# Altium project FPGA_SHIELD_MARK1.PrjPcb (part 1 of 2)
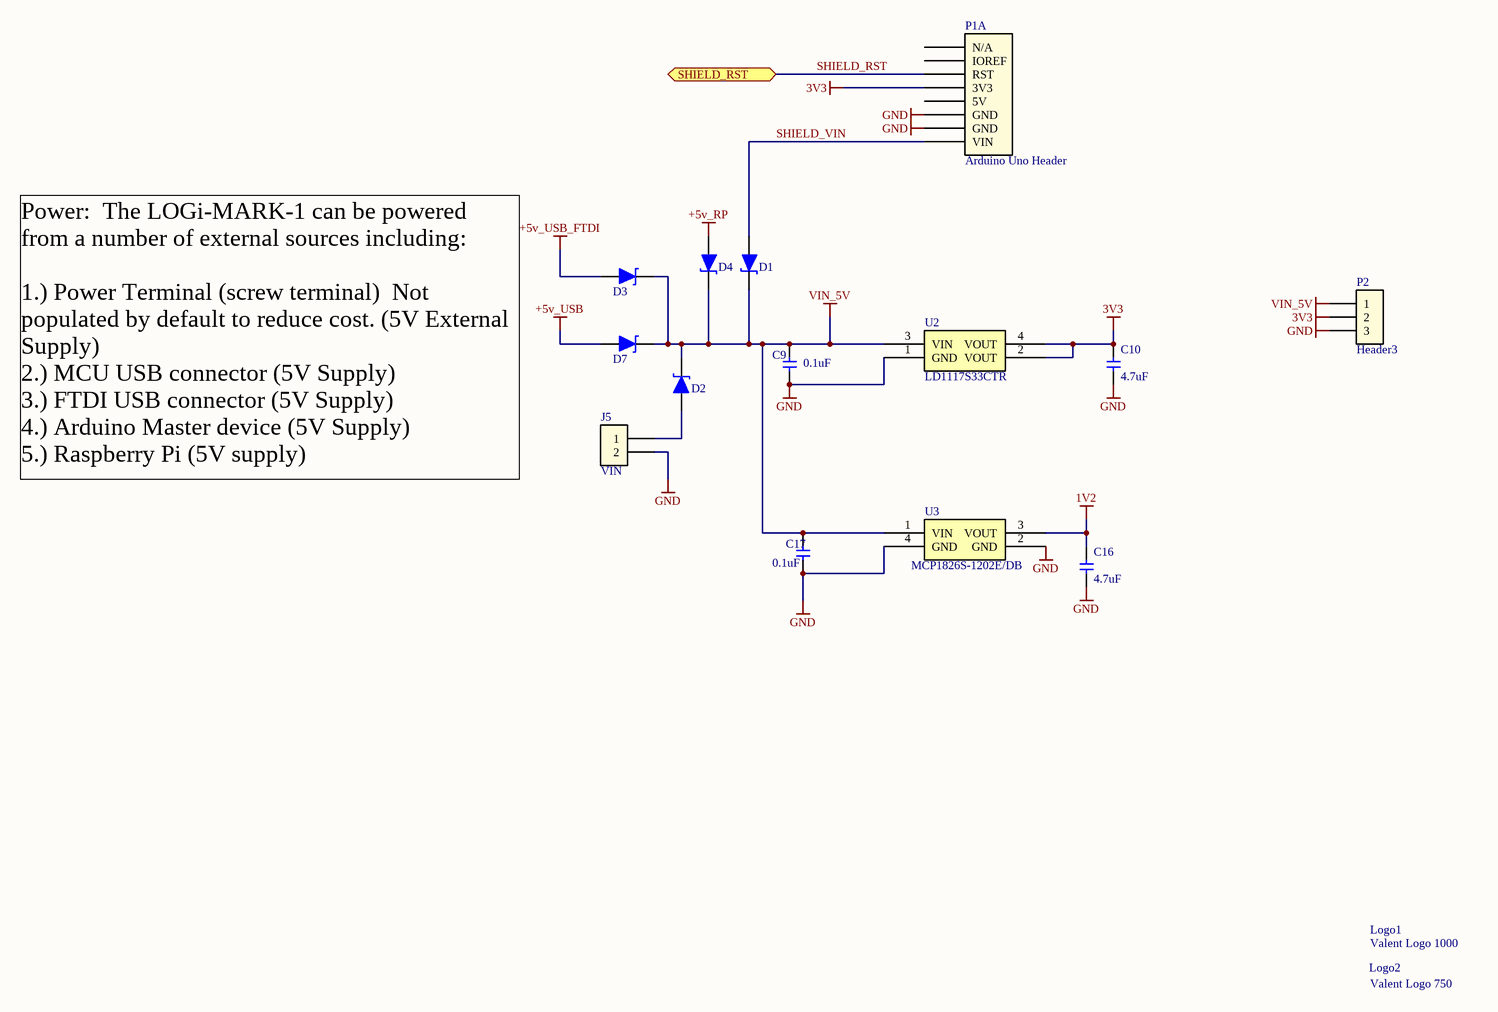
[diagram p0: POWER_SUPPLY.SchDoc]
Engineer: MJ/EH; PCB_TITLE: FPGA Mark 1; PCB_VERSION: a
7 sheets, 176 parts. Net scope: flat (ports and power ports of the same name join across sheets).
Board files: FPGA_SHIELD_MARK1_RA1_2.PcbDoc, MARK1_PANEL.PcbDoc
Sheets:
  POWER_SUPPLY.SchDoc
  LOGIC_FPGA.SchDoc
  FPGA_POWER_AND_CONFIGURATION.SchDoc
  DIGITAL_IO.SchDoc
  LOGIC_MCU.SchDoc
  PMOD_IO.SchDoc
  PERIPHERAL_PORT_IO.SchDoc

## Sheet POWER_SUPPLY.SchDoc: Power Supply
size B; Engineer: M. Jones; Organization: Michael Jones; DocumentNumber: 1; Revision: RA.1; SheetNumber: 1; SheetTotal: 7

### Parts
C9  0.1uF  [C0603]
C10  4.7uF  [C0603]
C16  4.7uF  [C0603]
C17  0.1uF  [C0603]
D1  RB161M-20TR  [SOD-123]  (value not drawn)
D2  RB161M-20TR  [SOD-123]  (value not drawn)
D3  RB161M-20TR  [SOD-123]  (value not drawn)
D4  RB161M-20TR  [SOD-123]  (value not drawn)
D7  RB161M-20TR  [SOD-123]  (value not drawn)
J5  VIN  [HEADER_2_40_100 THRU SIP]
Logo1  Valent Logo 1000  [ValentFX_1000]
Logo2  Valent Logo 750  [ValentFX_750]
P1  Arduino Uno Header  [Arduino Shield - smaller Thru]  (part A of 4)
P2  Header3  [HEADER_3_40_100 THRU SIP]
U2  LD1117S33CTR  [SOT223]
U3  MCP1826S-1202E/DB  [SOT223]

### Ports
SHIELD_RST

### Nets
1V2: C16.2 U3.3(VOUT)
3V3: C10.2 P1.A2(3V3) P2.2 U2.2(VOUT) U2.4(VOUT)
+5v_RP: D4.2(A)
+5v_USB: D7.2(A)
+5v_USB_FTDI: D3.2(A)
GND: C9.1 C10.1 C16.1 C17.1 J5.2 P1.A4(GND) P1.A5(GND) P2.3 U2.1(GND) U3.2(GND) U3.4(GND)
VIN_5V: C9.2 C17.2 D1.1(C) D2.1(C) D3.1(C) D4.1(C) D7.1(C) P2.1 U2.3(VIN) U3.1(VIN)
SHIELD_RST: P1.A1(RST) ; port SHIELD_RST
SHIELD_VIN: D1.2(A) P1.A6(VIN)
NetD2_2: D2.2(A) J5.1

Not connected (* = marked no-connect by the designer): P1 A0(IOREF) A3(5V) A-1(N/A)

### Notes on the sheet
- Power:  The LOGi-MARK-1 can be powered from a number of external sources including:
  1.) Power Terminal (screw terminal)  Not populated by default to reduce cost. (5V External Supply)
  2.) MCU USB connector (5V Supply)
  3.) FTDI USB connector (5V Supply)
  4.) Arduino Master device (5V Supply)
  5.) Raspberry Pi (5V supply)
- Title
- Revision:
- Sheet
- of
- Date:
- Engineer:
- (in symbol Valent Logo 750) VALENTFX-LOGO-750

### Library data of the parts
C9 C17 = GRM188R71H104KA93D: CAP CER .1UF 50V 10% X7R 0603; Manufacturer: Murata Electronics North America; Capacitance: 0.1µF; Value: 0.1uF; Supplier 1: Digi-Key; Supplier Part Number 1: 490-1519-1-ND; Manufacturer Part Number: GRM188R71H104KA93D; RoHS: RoHS Compliant; Category: Capacitors; Stock 1: 6315460; Pricing 1: 10=0.037, 100=0.0221, 500=0.01276, 1000=0.00884 (USD); Voltage - Rated: 50V; Tolerance: ±10%; Temperature Coefficient: X7R; Mounting Type: Surface Mount, MLCC; Operating Temperature: -55°C ~ 125°C; Features: -; Applications: General Purpose; Ratings: -; Package / Case: 0603 (1608 Metric); Size / Dimension: 0.063" L x 0.031" W (1.60mm x 0.80mm); Lead Spacing: -; Thickness: 0.80mm; Packaging: Cut Tape (CT); Lead Style: -; ComponentLink1URL: http://search.murata.co.jp/Ceramy/image/img/PDF/ENG/GRM188R71H104KA93.pdf; ComponentLink1Description: http://search.murata.co.jp/Ceramy/image/img/PDF/ENG/GRM188R71H104KA93.pdf
C10 C16 = GRM188R60J475KE19D: CAP CER 4.7UF 6.3V X5R 0603; Manufacturer: Murata Electronics North America; Capacitance: 4.7µF; Tolerance: ±10%; Supplier 1: Digi-Key; Supplier Part Number 1: 490-3297-1-ND; Manufacturer Part Number: GRM188R60J475KE19D; RoHS: RoHS Compliant; Category: Capacitors; Stock 1: 714091; Pricing 1: 10=0.214, 50=0.148, 100=0.1142, 250=0.08204, 500=0.0585, 1000=0.04281 (USD); Voltage - Rated: 6.3V; Temperature Coefficient: X5R; Mounting Type: Surface Mount, MLCC; Operating Temperature: -55°C ~ 85°C; Applications: General Purpose; Ratings: -; Package / Case: 0603 (1608 Metric); Size / Dimension: 0.063" L x 0.031" W (1.60mm x 0.80mm); Height: -; Thickness: 0.035" (0.90mm); Lead Spacing: -; Features: -; Packaging: Cut Tape (CT); Lead Style: -; ComponentLink1URL: http://search.murata.co.jp/Ceramy/image/img/PDF/ENG/GRM188R60J475KE19.pdf; ComponentLink1Description: http://search.murata.co.jp/Ceramy/image/img/PDF/ENG/GRM188R60J475KE19.pdf; Value: 4.7uF
D1-D4 D7 = RB161M-20TR: DIODE SCHOTTKY 25V 1A SOD123; Source Part Number: RB161M-20CT-ND; Manufacturer: Diodes Inc; Manufacturer Part Number: Rohm Semiconductor; Description: DIODE SCHOTTKY 20V 1A SOD123; Voltage - Forward (Vf) (Max) @ If: 350mV @ 1A; Voltage - DC Reverse (Vr) (Max): 20V; Current - Reverse Leakage @ Vr: 700µA @ 20V; Speed: Fast Recovery =< 500ns, > 200mA (Io); Source: Digikey; Value: RB161M-20TR; Supplier 1: Digi-Key; RoHS: RoHS Compliant; Category: Discrete Semiconductor Products; Stock 1: 29589; Pricing 1: 1=0.58, 25=0.4044, 100=0.3465, 250=0.29924, 500=0.25726, 1000=0.1995 (USD); Current - Average Rectified (Io): 1A; Diode Type: Schottky; Reverse Recovery Time (trr): -; Capacitance @ Vr, F: -; Mounting Type: Surface Mount; Package / Case: SOD-123F; Supplier Device Package: PMDU; Packaging: Cut Tape (CT); ComponentLink1URL: http://www.rohm.com/products/databook/di/pdf/rb161m-20.pdf; ComponentLink1Description: http://www.rohm.com/products/databook/di/pdf/rb161m-20.pdf; Supplier Part Number 1: RB161M-20CT-ND
J5 = Header2: Header 2 pin
P1 = Arduino Shield: Arduino Duem Header
P2 = Header3: Header  pin
U2 = LD1117S33CTR: IC REG LDO 3.3V 950MA SOT-223; Manufacturer: STMicroelectronics; Regulator Topology: Positive Fixed; Voltage - Input: Up to 15V; Voltage - Dropout (Typical): 1.1V @ 800mA; Number of Regulators: 1; Supplier 1: Digi-Key; Supplier Part Number 1: 497-1241-1-ND; Manufacturer Part Number: LD1117S33CTR; RoHS: RoHS Compliant; Category: Integrated Circuits (ICs); Stock 1: 20460; Pricing 1: 1=0.54, 10=0.436, 100=0.3267, 250=0.28216, 500=0.24256, 1000=0.1881 (USD); Voltage - Output: 3.3V; Current - Output: 950mA; Current - Limit (Min): -; Operating Temperature: -40°C ~ 125°C; Mounting Type: Surface Mount; Package / Case: TO-261-4, TO-261AA; Supplier Device Package: SOT-223; Packaging: Cut Tape (CT); ComponentLink1URL: http://www.st.com/internet/com/TECHNICAL_RESOURCES/TECHNICAL_LITERATURE/DATASHEET/CD00000544.pdf; ComponentLink1Description: http://www.st.com/internet/com/TECHNICAL_RESOURCES/TECHNICAL_LITERATURE/DATASHEET/CD00000544.pdf; value: LD1117S33CTR
U3 = MCP1826S-1202E/DB: IC LDO REG 1A 1.2V SOT223-3; Manufacturer: Microchip Technology; Regulator Topology: Positive Fixed; Voltage - Input: Up to 6V; Voltage - Dropout (Typical): 0.25V @ 1A; Number of Regulators: 1; Current - Output: 1A (Min); Value: MCP1826S-1202E/DB; Supplier 1: Digi-Key; Supplier Part Number 1: MCP1826S-1202E/DB-ND; Manufacturer Part Number: MCP1826S-1202E/DB; RoHS: RoHS Compliant; Category: Integrated Circuits (ICs); Stock 1: 2041; Pricing 1: 1=0.74, 10=0.68, 25=0.57, 100=0.52 (USD); Voltage - Output: 1.2V; Current - Limit (Min): -; Operating Temperature: -40°C ~ 125°C; Mounting Type: Surface Mount; Package / Case: TO-261-4, TO-261AA; Supplier Device Package: SOT-223-3; Packaging: Tube; ComponentLink1URL: http://ww1.microchip.com/downloads/en/DeviceDoc/22057a.pdf; ComponentLink1Description: http://ww1.microchip.com/downloads/en/DeviceDoc/22057a.pdf

## Sheet LOGIC_FPGA.SchDoc: FPGA Logic
size B; Engineer: M. Jones; Organization: Michael Jones; DocumentNumber: 2; Revision: RA.1; SheetNumber: 2; SheetTotal: 7
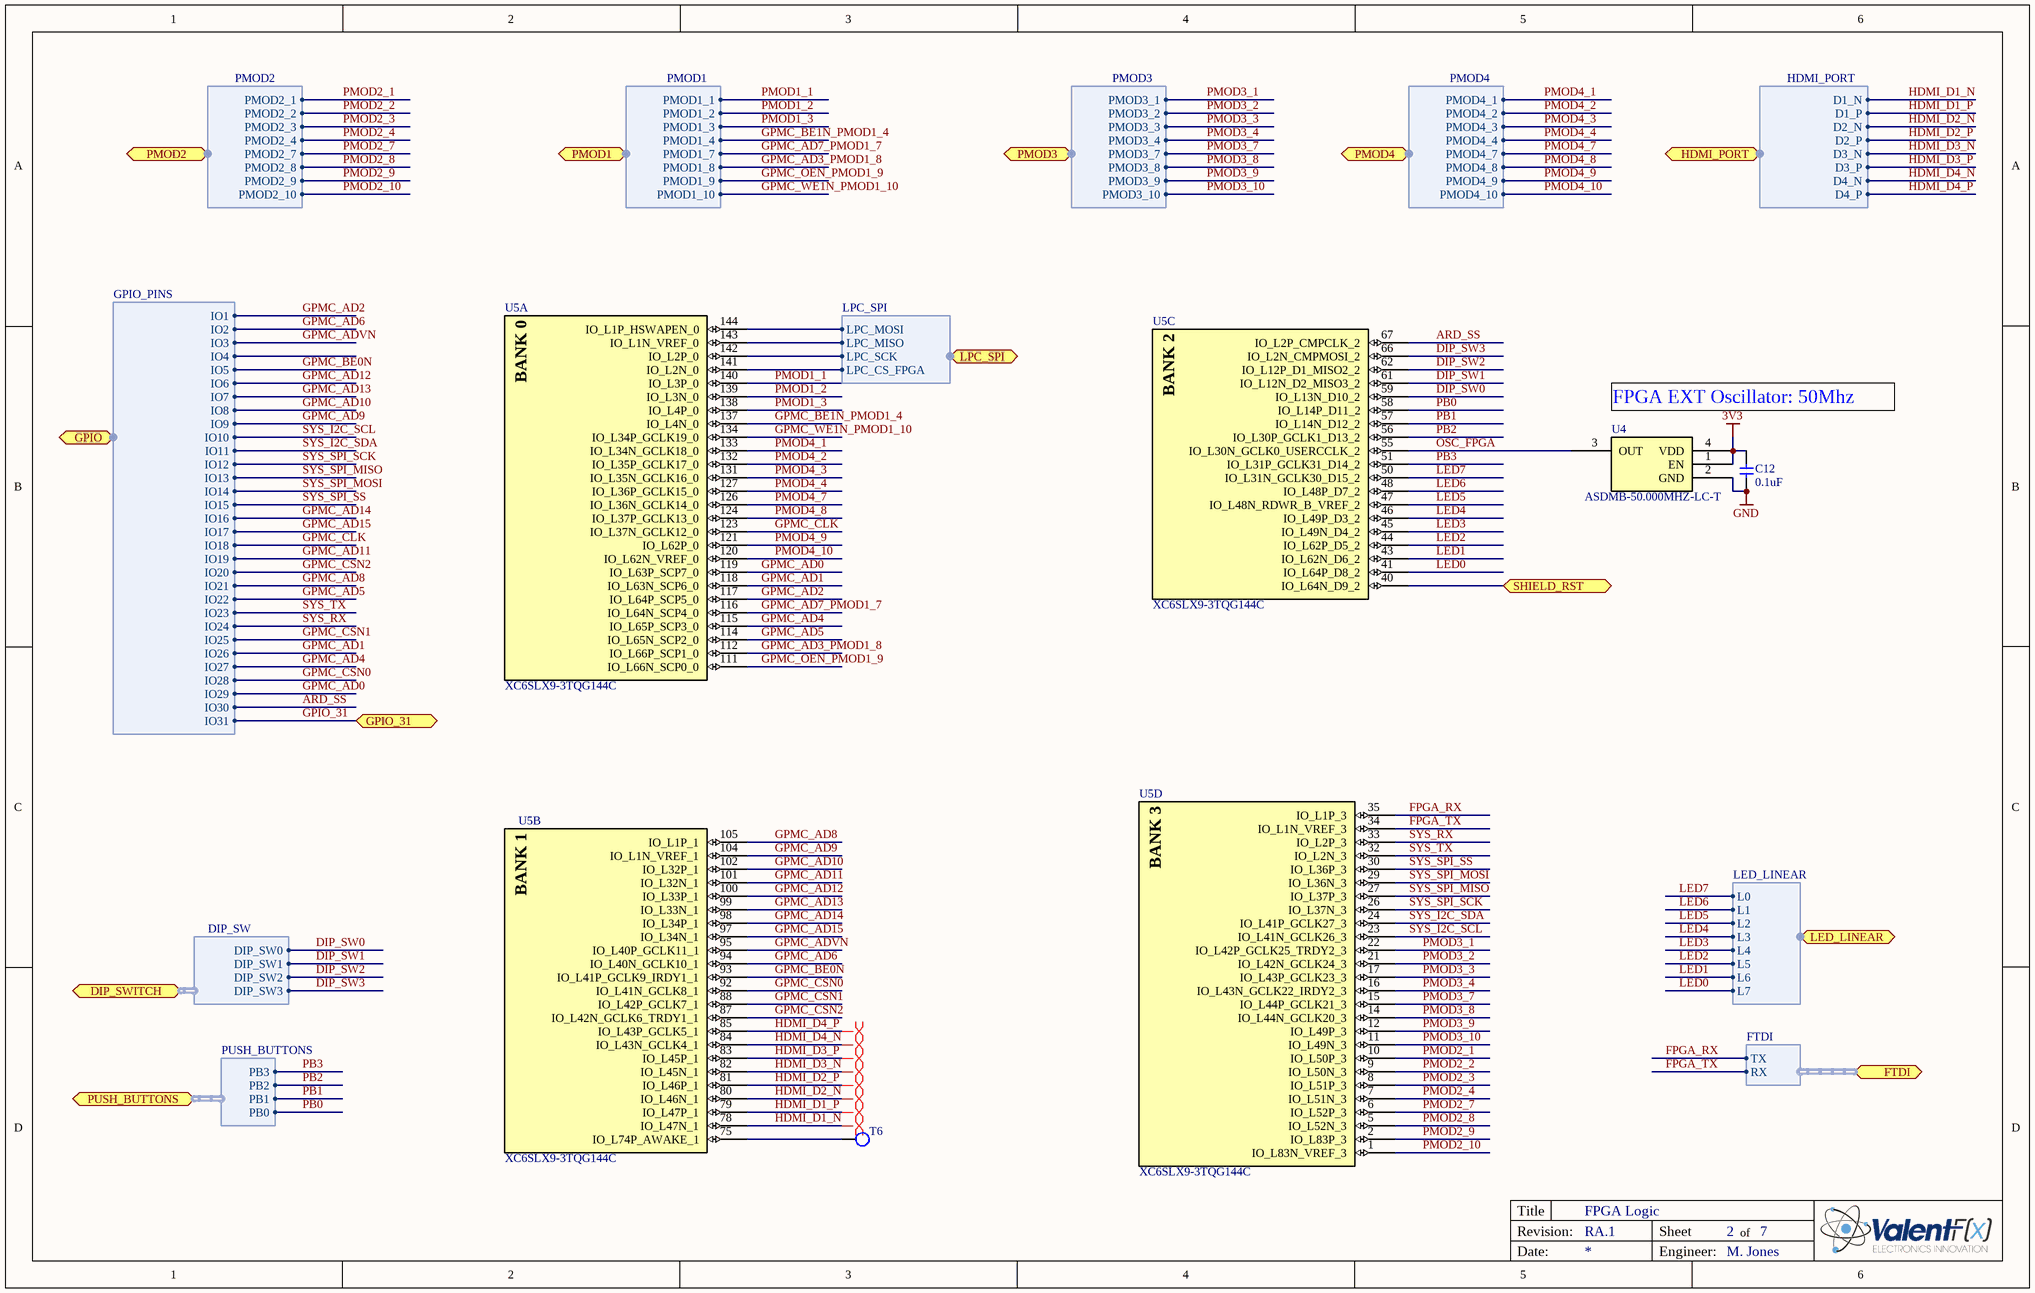
[diagram p1: LOGIC_FPGA.SchDoc]

### Parts
C12  0.1uF  [C0603]
T6  Test Point  [tp 18-28]  (value not drawn)
U4  ASDMB-50.000MHZ-LC-T  [ASDMB - osc]
U5  XC6SLX9-3TQG144C  [TQ144_L]  (parts A,B,C,D of 7)

### Ports
DIP_SWITCH (harness DIP_SW), FTDI (harness FTDI), GPIO (harness GPIO_PINS), GPIO_31, HDMI_PORT (harness HDMI_PORT), LED_LINEAR (harness LED_LINEAR), LPC_SPI (harness LPC_SPI), PMOD1 (harness PMOD1), PMOD2 (harness PMOD2), PMOD3 (harness PMOD3), PMOD4 (harness PMOD4), PUSH_BUTTONS (harness PUSH_BUTTONS), SHIELD_RST

### Harnesses
DIP_SW: DIP_SW0, DIP_SW1, DIP_SW2, DIP_SW3
PUSH_BUTTONS: PB0, PB1, PB2, PB3
LED_LINEAR: L0, L1, L2, L3, L4, L5, L6, L7
PMOD2: PMOD2_1, PMOD2_2, PMOD2_3, PMOD2_4, PMOD2_7, PMOD2_8, PMOD2_9, PMOD2_10
PMOD3: PMOD3_1, PMOD3_2, PMOD3_3, PMOD3_4, PMOD3_7, PMOD3_8, PMOD3_9, PMOD3_10
PMOD4: PMOD4_1, PMOD4_2, PMOD4_3, PMOD4_4, PMOD4_7, PMOD4_8, PMOD4_9, PMOD4_10
FTDI: TX, RX
GPIO_PINS: IO1, IO2, IO3, IO4, IO5, IO6, IO7, IO8, IO9, IO10, IO11, IO12, IO13, IO14, IO15, IO16, IO17, IO18, IO19, IO20, IO21, IO22, IO23, IO24, IO25, IO26, IO27, IO28, IO29, IO30, IO31
HDMI_PORT: D1_P, D1_N, D2_N, D3_N, D4_N, D2_P, D3_P, D4_P
LPC_SPI: LPC_MOSI, LPC_MISO, LPC_SCK, LPC_CS_FPGA
PMOD1: PMOD1_1, PMOD1_2, PMOD1_3, PMOD1_4, PMOD1_7, PMOD1_8, PMOD1_9, PMOD1_10

### Nets
3V3: C12.2 U4.1(EN) U4.4(VDD)
GND: C12.1 U4.2(GND)
ARD_SS: U5.67(IO_L2P_CMPCLK_2) ; port GPIO.IO30
DIP_SW0: U5.59(IO_L13N_D10_2) ; port DIP_SWITCH.DIP_SW0
DIP_SW1: U5.61(IO_L12N_D2_MISO3_2) ; port DIP_SWITCH.DIP_SW1
DIP_SW2: U5.62(IO_L12P_D1_MISO2_2) ; port DIP_SWITCH.DIP_SW2
DIP_SW3: U5.66(IO_L2N_CMPMOSI_2) ; port DIP_SWITCH.DIP_SW3
FPGA_RX: U5.35(IO_L1P_3) ; port FTDI.TX
FPGA_TX: U5.34(IO_L1N_VREF_3) ; port FTDI.RX
GPIO_31: port GPIO_31, port GPIO.IO31
GPMC_AD0: U5.119(IO_L63P_SCP7_0) ; port GPIO.IO29
GPMC_AD1: U5.118(IO_L63N_SCP6_0) ; port GPIO.IO26
GPMC_AD2: U5.117(IO_L64P_SCP5_0) ; port GPIO.IO1
GPMC_AD3_PMOD1_8: U5.112(IO_L66P_SCP1_0) ; port PMOD1.PMOD1_8
GPMC_AD4: U5.115(IO_L65P_SCP3_0) ; port GPIO.IO27
GPMC_AD5: U5.114(IO_L65N_SCP2_0) ; port GPIO.IO22
GPMC_AD6: U5.94(IO_L40N_GCLK10_1) ; port GPIO.IO2
GPMC_AD7_PMOD1_7: U5.116(IO_L64N_SCP4_0) ; port PMOD1.PMOD1_7
GPMC_AD8: U5.105(IO_L1P_1) ; port GPIO.IO21
GPMC_AD9: U5.104(IO_L1N_VREF_1) ; port GPIO.IO9
GPMC_AD10: U5.102(IO_L32P_1) ; port GPIO.IO8
GPMC_AD11: U5.101(IO_L32N_1) ; port GPIO.IO19
GPMC_AD12: U5.100(IO_L33P_1) ; port GPIO.IO6
GPMC_AD13: U5.99(IO_L33N_1) ; port GPIO.IO7
GPMC_AD14: U5.98(IO_L34P_1) ; port GPIO.IO16
GPMC_AD15: U5.97(IO_L34N_1) ; port GPIO.IO17
GPMC_ADVN: U5.95(IO_L40P_GCLK11_1) ; port GPIO.IO3
GPMC_BE0N: U5.93(IO_L41P_GCLK9_IRDY1_1) ; port GPIO.IO5
GPMC_BE1N_PMOD1_4: U5.137(IO_L4N_0) ; port PMOD1.PMOD1_4
GPMC_CLK: U5.123(IO_L37N_GCLK12_0) ; port GPIO.IO18
GPMC_CSN0: U5.92(IO_L41N_GCLK8_1) ; port GPIO.IO28
GPMC_CSN1: U5.88(IO_L42P_GCLK7_1) ; port GPIO.IO25
GPMC_CSN2: U5.87(IO_L42N_GCLK6_TRDY1_1) ; port GPIO.IO20
GPMC_OEN_PMOD1_9: U5.111(IO_L66N_SCP0_0) ; port PMOD1.PMOD1_9
GPMC_WE1N_PMOD1_10: U5.134(IO_L34P_GCLK19_0) ; port PMOD1.PMOD1_10
HDMI_D1_N: U5.78(IO_L47N_1) ; port HDMI_PORT.D1_N
HDMI_D1_P: U5.79(IO_L47P_1) ; port HDMI_PORT.D1_P
HDMI_D2_N: U5.80(IO_L46N_1) ; port HDMI_PORT.D2_N
HDMI_D2_P: U5.81(IO_L46P_1) ; port HDMI_PORT.D2_P
HDMI_D3_N: U5.82(IO_L45N_1) ; port HDMI_PORT.D3_N
HDMI_D3_P: U5.83(IO_L45P_1) ; port HDMI_PORT.D3_P
HDMI_D4_N: U5.84(IO_L43N_GCLK4_1) ; port HDMI_PORT.D4_N
HDMI_D4_P: U5.85(IO_L43P_GCLK5_1) ; port HDMI_PORT.D4_P
LED0: U5.41(IO_L64P_D8_2) ; port LED_LINEAR.L7
LED1: U5.43(IO_L62N_D6_2) ; port LED_LINEAR.L6
LED2: U5.44(IO_L62P_D5_2) ; port LED_LINEAR.L5
LED3: U5.45(IO_L49N_D4_2) ; port LED_LINEAR.L4
LED4: U5.46(IO_L49P_D3_2) ; port LED_LINEAR.L3
LED5: U5.47(IO_L48N_RDWR_B_VREF_2) ; port LED_LINEAR.L2
LED6: U5.48(IO_L48P_D7_2) ; port LED_LINEAR.L1
LED7: U5.50(IO_L31N_GCLK30_D15_2) ; port LED_LINEAR.L0
LPC_CS_FPGA: U5.141(IO_L2N_0) ; port LPC_SPI.LPC_CS_FPGA
MISO: U5.143(IO_L1N_VREF_0) ; port LPC_SPI.LPC_MISO
MOSI_SWO: U5.144(IO_L1P_HSWAPEN_0) ; port LPC_SPI.LPC_MOSI
OSC_FPGA: U4.3(OUT) U5.55(IO_L30N_GCLK0_USERCCLK_2)
PB0: U5.58(IO_L14P_D11_2) ; port PUSH_BUTTONS.PB0
PB1: U5.57(IO_L14N_D12_2) ; port PUSH_BUTTONS.PB1
PB2: U5.56(IO_L30P_GCLK1_D13_2) ; port PUSH_BUTTONS.PB2
PB3: U5.51(IO_L31P_GCLK31_D14_2) ; port PUSH_BUTTONS.PB3
PMOD1_1: U5.140(IO_L3P_0) ; port PMOD1.PMOD1_1
PMOD1_2: U5.139(IO_L3N_0) ; port PMOD1.PMOD1_2
PMOD1_3: U5.138(IO_L4P_0) ; port PMOD1.PMOD1_3
PMOD2_1: U5.10(IO_L50P_3) ; port PMOD2.PMOD2_1
PMOD2_2: U5.9(IO_L50N_3) ; port PMOD2.PMOD2_2
PMOD2_3: U5.8(IO_L51P_3) ; port PMOD2.PMOD2_3
PMOD2_4: U5.7(IO_L51N_3) ; port PMOD2.PMOD2_4
PMOD2_7: U5.6(IO_L52P_3) ; port PMOD2.PMOD2_7
PMOD2_8: U5.5(IO_L52N_3) ; port PMOD2.PMOD2_8
PMOD2_9: U5.2(IO_L83P_3) ; port PMOD2.PMOD2_9
PMOD2_10: U5.1(IO_L83N_VREF_3) ; port PMOD2.PMOD2_10
PMOD3_1: U5.22(IO_L42P_GCLK25_TRDY2_3) ; port PMOD3.PMOD3_1
PMOD3_2: U5.21(IO_L42N_GCLK24_3) ; port PMOD3.PMOD3_2
PMOD3_3: U5.17(IO_L43P_GCLK23_3) ; port PMOD3.PMOD3_3
PMOD3_4: U5.16(IO_L43N_GCLK22_IRDY2_3) ; port PMOD3.PMOD3_4
PMOD3_7: U5.15(IO_L44P_GCLK21_3) ; port PMOD3.PMOD3_7
PMOD3_8: U5.14(IO_L44N_GCLK20_3) ; port PMOD3.PMOD3_8
PMOD3_9: U5.12(IO_L49P_3) ; port PMOD3.PMOD3_9
PMOD3_10: U5.11(IO_L49N_3) ; port PMOD3.PMOD3_10
PMOD4_1: U5.133(IO_L34N_GCLK18_0) ; port PMOD4.PMOD4_1
PMOD4_2: U5.132(IO_L35P_GCLK17_0) ; port PMOD4.PMOD4_2
PMOD4_3: U5.131(IO_L35N_GCLK16_0) ; port PMOD4.PMOD4_3
PMOD4_4: U5.127(IO_L36P_GCLK15_0) ; port PMOD4.PMOD4_4
PMOD4_7: U5.126(IO_L36N_GCLK14_0) ; port PMOD4.PMOD4_7
PMOD4_8: U5.124(IO_L37P_GCLK13_0) ; port PMOD4.PMOD4_8
PMOD4_9: U5.121(IO_L62P_0) ; port PMOD4.PMOD4_9
PMOD4_10: U5.120(IO_L62N_VREF_0) ; port PMOD4.PMOD4_10
SCK: U5.142(IO_L2P_0) ; port LPC_SPI.LPC_SCK
SHIELD_RST: U5.40(IO_L64N_D9_2) ; port SHIELD_RST
SYS_I2C_SCL: U5.23(IO_L41N_GCLK26_3) ; port GPIO.IO10
SYS_I2C_SDA: U5.24(IO_L41P_GCLK27_3) ; port GPIO.IO11
SYS_RX: U5.33(IO_L2P_3) ; port GPIO.IO24
SYS_SPI_MISO: U5.27(IO_L37P_3) ; port GPIO.IO13
SYS_SPI_MOSI: U5.29(IO_L36N_3) ; port GPIO.IO14
SYS_SPI_SCK: U5.26(IO_L37N_3) ; port GPIO.IO12
SYS_SPI_SS: U5.30(IO_L36P_3) ; port GPIO.IO15
SYS_TX: U5.32(IO_L2N_3) ; port GPIO.IO23
NetT6_1: T6.1 U5.75(IO_L74P_AWAKE_1)

### Layout directives
differential pair: HDMI_D1_N, HDMI_D1_P, HDMI_D2_N, HDMI_D2_P, HDMI_D3_N, HDMI_D3_P, HDMI_D4_N, HDMI_D4_P

### Notes on the sheet
- FPGA EXT Oscillator: 50Mhz
- Title
- Revision:
- Sheet
- of
- Date:
- Engineer:
- (in symbol XC6SLX9-3TQG144C, part A) BANK 0
- (in symbol XC6SLX9-3TQG144C, part B) BANK 1
- (in symbol XC6SLX9-3TQG144C, part C) BANK 2
- (in symbol XC6SLX9-3TQG144C, part D) BANK 3

### Library data of the parts
C12 = GRM188R71H104KA93D: as C9 on sheet POWER_SUPPLY; Manufacturer Part Number: GRM188R71H104KA93D; Value: CAP CER .1UF 50V 10% X7R 0603; Supplier 1: Digi-Key; Supplier Part Number 1: 490-1519-1-ND; RoHS: RoHS Compliant; Category: Capacitors; Stock 1: 9370695; Pricing 1: 10=0.037, 100=0.0221, 500=0.01276, 1000=0.00884 (USD); Voltage - Rated: 50V; Tolerance: ±10%; Temperature Coefficient: X7R; Mounting Type: Surface Mount, MLCC; Operating Temperature: -55°C ~ 125°C; Features: -; Applications: General Purpose; Ratings: -; Package / Case: 0603 (1608 Metric); Size / Dimension: 0.063" L x 0.031" W (1.60mm x 0.80mm); Lead Spacing: -; Thickness: 0.80mm; Packaging: Cut Tape (CT); Lead Style: -; ComponentLink1URL: http://search.murata.co.jp/Ceramy/image/img/PDF/ENG/GRM188R71H104KA93.pdf; ComponentLink1Description: http://search.murata.co.jp/Ceramy/image/img/PDF/ENG/GRM188R71H104KA93.pdf
T6 = Test Point 2: Test Point Smaller Symbol
U4 = ASDMB-50.000MHZ-LC-T: OSC MEMS 50.000 MHZ SMD; Manufacturer: Abracon Corporation; Frequency: 50MHz; Function: Tri-State (Output Enable); Output: CMOS; Voltage - Supply: 1.8 V ~ 3.3 V; Frequency Stability: ±50ppm; Current - Supply (Max): 16mA; Current - Supply (Disable) (Max): 15µA; Supplier 1: Digi-Key; Manufacturer Part Number: ASDMB-50.000MHZ-LC-T; RoHS: RoHS Compliant; Category: Crystals and Oscillators; Stock 1: 967; Pricing 1: 1=1.69, 10=1.463, 50=1.2826, 100=1.0125, 500=0.855 (USD); Type: MEMS (Silicon); Operating Temperature: -40°C ~ 85°C; Mounting Type: Surface Mount; Size / Dimension: 0.098" L x 0.079" W (2.50mm x 2.00mm); Height: 0.035" (0.90mm); Package / Case: 4-SMD, No Lead (DFN, LCC); Packaging: Cut Tape (CT); ComponentLink1URL: http://www.abracon.com/Oscillators/ASDMB.pdf; ComponentLink1Description: http://www.abracon.com/Oscillators/ASDMB.pdf; Supplier Part Number 1: 535-11738-1-ND; Value: ASDMB-50.000MHZ-LC-T
U5 = XC6SLX9-3TQG144C: IC FPAG SPARTAN 6 9K 144TQFP; Manufacturer: Xilinx Inc; Number of Logic Elements/Cells: 9152; Number of LABs/CLBs: 715; Total RAM Bits: 589824; Number of I /O: 102; Voltage - Supply: 1.14 V ~ 1.26 V; Supplier 1: Digi-Key; Supplier Part Number 1: 122-1747-ND; Manufacturer Part Number: XC6SLX9-3TQG144C; RoHS: RoHS Compliant; Category: Integrated Circuits (ICs); Stock 1: 77; Pricing 1: 1=17.22 (USD); Number of Gates: -; Mounting Type: Surface Mount; Operating Temperature: 0°C ~ 85°C; Package / Case: 144-LQFP; Supplier Device Package: 144-TQFP (20x20); ComponentLink1URL: http://www.xilinx.com/support/documentation/data_sheets/ds160.pdf; ComponentLink1Description: http://www.xilinx.com/support/documentation/data_sheets/ds160.pdf; Value: XC6SLX9-3TQG144C

## Sheet FPGA_POWER_AND_CONFIGURATION.SchDoc: FPGA Configuration
size B; Engineer: M. Jones; Organization: Michael Jones; DocumentNumber: 3; Revision: RA.1; SheetNumber: 3; SheetTotal: 7
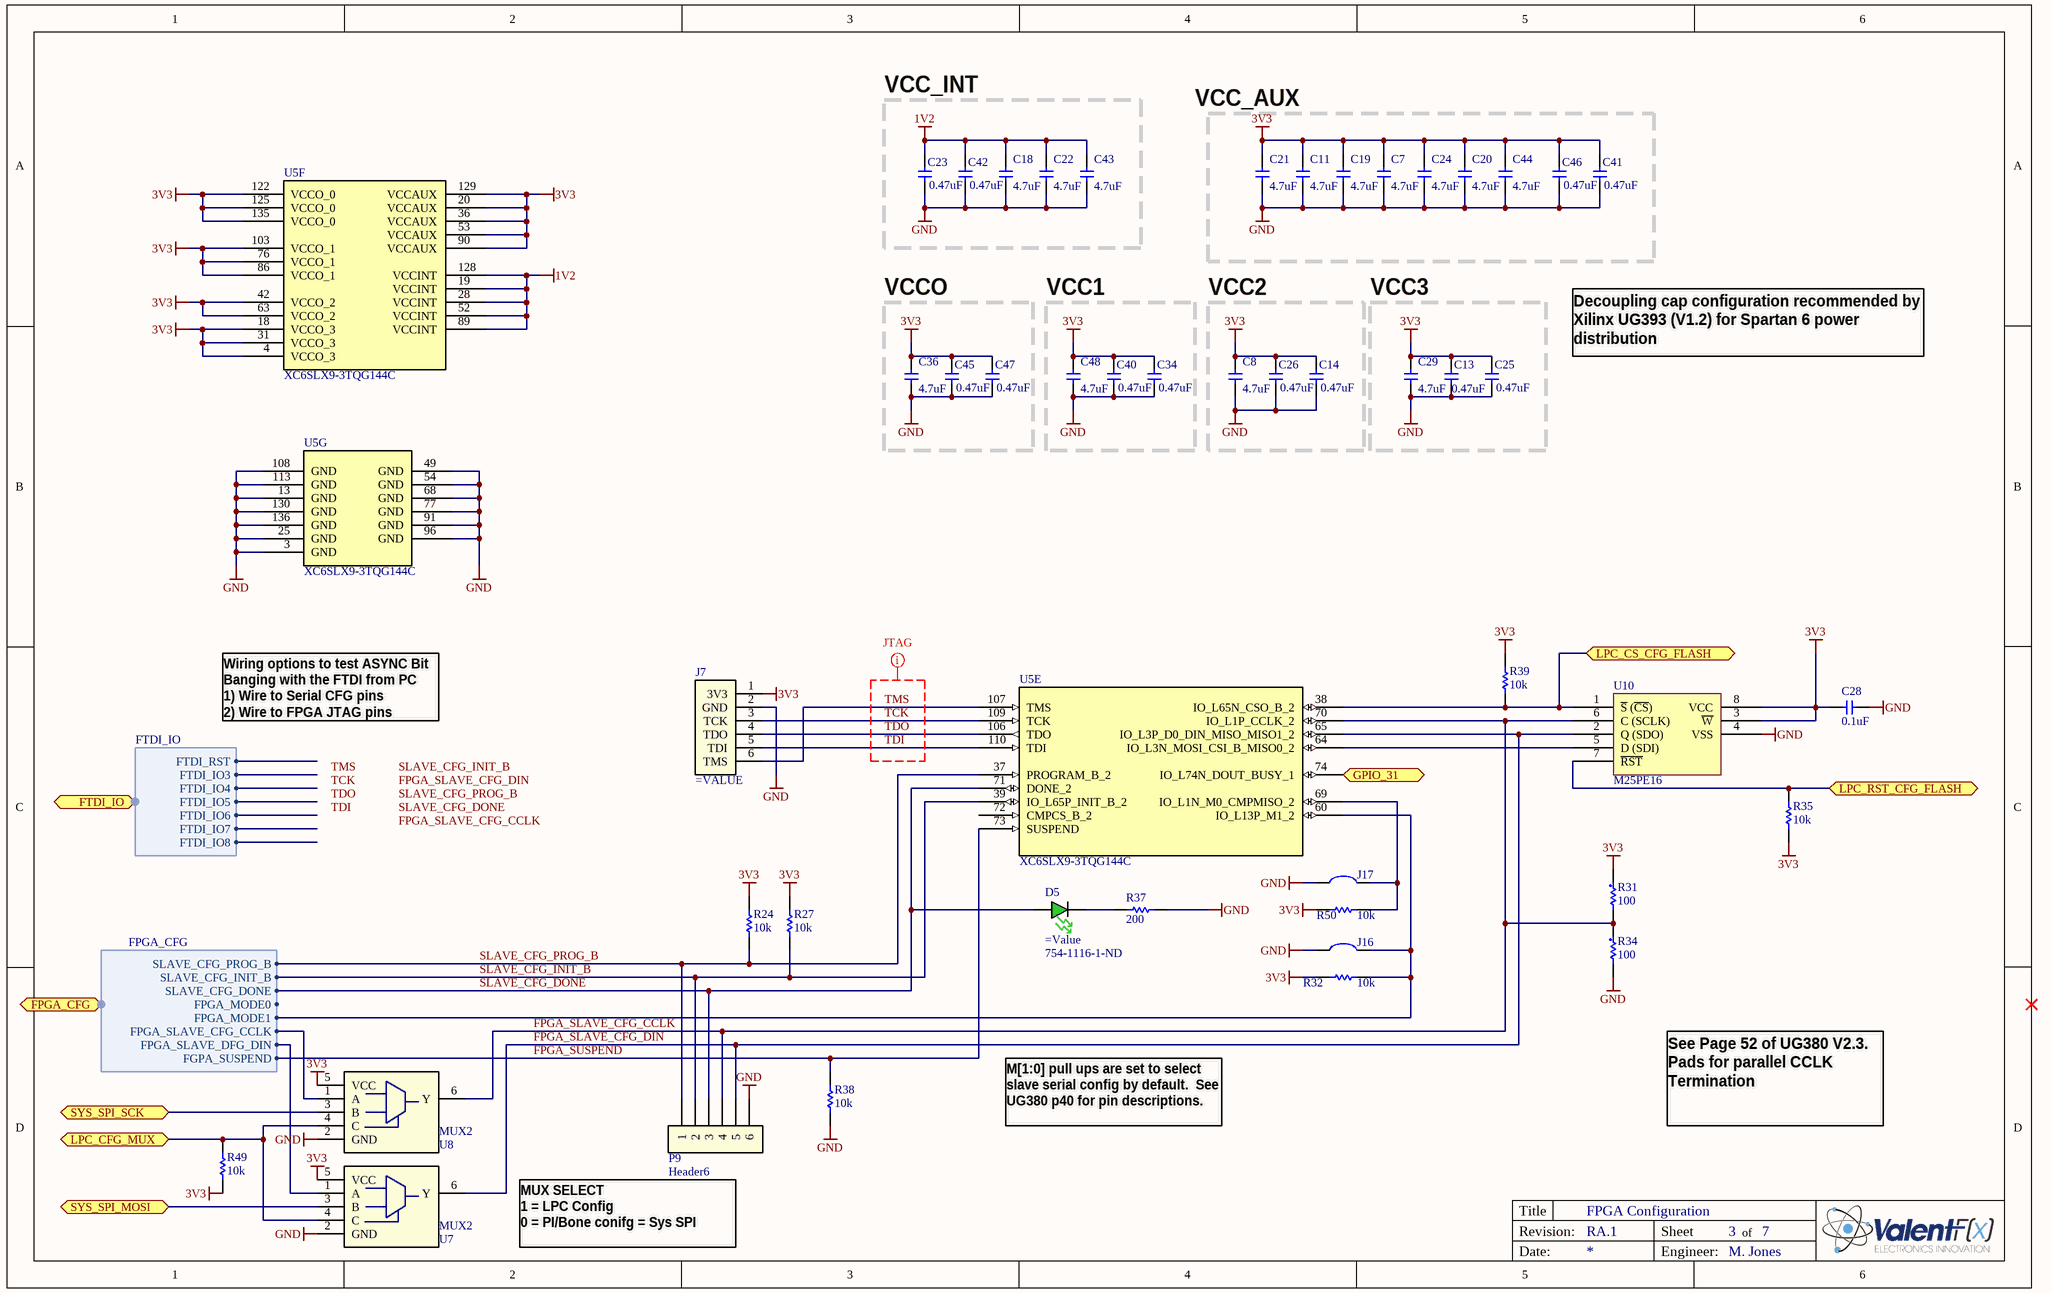
[diagram p2: FPGA_POWER_AND_CONFIGURATION.SchDoc]

### Parts
C7  4.7uF  [C0603]
C8  4.7uF  [C0603]
C11  4.7uF  [C0603]
C13  0.47uF  [C0603]
C14  0.47uF  [C0603]
C18  4.7uF  [C0603]
C19  4.7uF  [C0603]
C20  4.7uF  [C0603]
C21  4.7uF  [C0603]
C22  4.7uF  [C0603]
C23  0.47uF  [C0603]
C24  4.7uF  [C0603]
C25  0.47uF  [C0603]
C26  0.47uF  [C0603]
C28  0.1uF  [C0603]
C29  4.7uF  [C0603]
C34  0.47uF  [C0603]
C36  4.7uF  [C0603]
C40  0.47uF  [C0603]
C41  0.47uF  [C0603]
C42  0.47uF  [C0603]
C43  4.7uF  [C0603]
C44  4.7uF  [C0603]
C45  0.47uF  [C0603]
C46  0.47uF  [C0603]
C47  0.47uF  [C0603]
C48  4.7uF  [C0603]
D5  Supplier Part Number 1: 754-1116-1-ND  [LED_0603 - GREEN]
J7  (no value)  [JTAG - Digilent HS1]
J16  Solder Jumper  [SOLDER_JUMPER]  (value not drawn)  (no BOM)
J17  Solder Jumper  [SOLDER_JUMPER]  (value not drawn)  (no BOM)
P9  Header6  [HEADER_6_30_100 SMT SIP]
R24  10k  [R0603]
R27  10k  [R0603]
R31  100  [R0603]
R32  10k  [R0603]
R34  100  [R0603]
R35  10k  [R0603]
R37  200  [R0603]
R38  10k  [R0603]
R39  10k  [R0603]
R49  10k  [R0603]
R50  10k  [R0603]
U5  XC6SLX9-3TQG144C  [TQ144_L]  (parts E,F,G of 7)
U7  MUX2  [SC70-6]
U8  MUX2  [SC70-6]
U10  M25PE16  [SOIC127P830X200-8L]

### Blocks framed on the sheet
VCC_INT: C18 C22 C23 C42 C43
VCCO: C36 C45 C47
VCC1: C34 C40 C48
VCC2: C8 C14 C26
VCC3: C13 C25 C29

### Ports
FPGA_CFG (harness FPGA_CFG), FTDI_IO (harness FTDI_IO), GPIO_31, LPC_CFG_MUX, LPC_CS_CFG_FLASH, LPC_RST_CFG_FLASH, SYS_SPI_MOSI, SYS_SPI_SCK

### Harnesses
FPGA_CFG: SLAVE_CFG_PROG_B, SLAVE_CFG_INIT_B, SLAVE_CFG_DONE, FPGA_MODE0, FPGA_MODE1, FPGA_SLAVE_CFG_CCLK, FPGA_SLAVE_DFG_DIN, FGPA_SUSPEND
FTDI_IO: FTDI_IO3, FTDI_IO4, FTDI_IO5, FTDI_IO6, FTDI_IO7, FTDI_IO8, FTDI_RST

### Nets
1V2: C18.2 C22.2 C23.2 C42.2 C43.2 U5.19(VCCINT) U5.28(VCCINT) U5.52(VCCINT) U5.89(VCCINT) U5.128(VCCINT)
3V3: C7.2 C8.2 C11.2 C13.2 C14.2 C19.2 C20.2 C21.2 C24.2 C25.2 C26.2 C28.1 C29.2 C34.2 C36.2 C40.2 C41.2 C44.2 C45.2 C46.2 C47.2 C48.2 J7.1(3V3) R24.2 R27.2 R31.1 R32.1 R35.2 R39.2 R49.1 R50.1 U5.4(VCCO_3) U5.18(VCCO_3) U5.20(VCCAUX) U5.31(VCCO_3) U5.36(VCCAUX) U5.42(VCCO_2) U5.53(VCCAUX) U5.63(VCCO_2) U5.76(VCCO_1) U5.86(VCCO_1) U5.90(VCCAUX) U5.103(VCCO_1) U5.122(VCCO_0) U5.125(VCCO_0) U5.129(VCCAUX) U5.135(VCCO_0) U7.5(VCC) U8.5(VCC) U10.3(~{W}) U10.8(VCC)
GND: C7.1 C8.1 C11.1 C13.1 C14.1 C18.1 C19.1 C20.1 C21.1 C22.1 C23.1 C24.1 C25.1 C26.1 C28.2 C29.1 C34.1 C36.1 C40.1 C41.1 C42.1 C43.1 C44.1 C45.1 C46.1 C47.1 C48.1 J7.2(GND) J16.2 J17.2 P9.6 R34.2 R37.2 R38.1 U5.3(GND) U5.13(GND) U5.25(GND) U5.49(GND) U5.54(GND) U5.68(GND) U5.77(GND) U5.91(GND) U5.96(GND) U5.108(GND) U5.113(GND) U5.130(GND) U5.136(GND) U7.2(GND) U8.2(GND) U10.4(VSS)
CS_FPGA_FLASH: R39.1 U5.38(IO_L65N_CSO_B_2) U10.1(~{S}_(~{CS})) ; port LPC_CS_CFG_FLASH
FPGA_MODE1: J16.1 R32.2 U5.60(IO_L13P_M1_2) ; port FPGA_CFG.FPGA_MODE1
FPGA_SLAVE_CFG_CCLK: P9.4 R31.2 R34.1 U5.70(IO_L1P_CCLK_2) U8.6(Y) U10.6(C_(SCLK))
FPGA_SLAVE_CFG_DIN: P9.5 U5.65(IO_L3P_D0_DIN_MISO_MISO1_2) U7.6(Y) U10.2(Q_(SDO))
FPGA_SUSPEND: R38.2 U5.73(SUSPEND) ; port FPGA_CFG.FGPA_SUSPEND
GPIO_31: U5.74(IO_L74N_DOUT_BUSY_1) ; port GPIO_31
LPC_FPGA_SLAVE_CFG_CCLK: U8.1(A) ; port FPGA_CFG.FPGA_SLAVE_CFG_CCLK
LPC_FPGA_SLAVE_CFG_DIN: U7.1(A) ; port FPGA_CFG.FPGA_SLAVE_DFG_DIN
SLAVE_CFG_DONE: D5.A P9.3 U5.71(DONE_2) ; port FPGA_CFG.SLAVE_CFG_DONE
SLAVE_CFG_INIT_B: P9.2 R27.1 U5.39(IO_L65P_INIT_B_2) ; port FPGA_CFG.SLAVE_CFG_INIT_B
SLAVE_CFG_PROG_B: P9.1 R24.1 U5.37(PROGRAM_B_2) ; port FPGA_CFG.SLAVE_CFG_PROG_B
SYS_SPI_MOSI: U7.3(B) ; port SYS_SPI_MOSI
SYS_SPI_SCK: U8.3(B) ; port SYS_SPI_SCK
TCK: J7.3(TCK) U5.109(TCK)
TDI: J7.5(TDI) U5.110(TDI)
TDO: J7.4(TDO) U5.106(TDO)
TMS: J7.6(TMS) U5.107(TMS)
NetD5_C: D5.C R37.1
NetJ17_1: J17.1 R50.2 U5.69(IO_L1N_M0_CMPMISO_2)
NetR35_1: R35.1 U10.7(~{RST}) ; port LPC_RST_CFG_FLASH
NetR49_2: R49.2 U7.4(C) U8.4(C) ; port LPC_CFG_MUX
NetU5_64: U5.64(IO_L3N_MOSI_CSI_B_MISO0_2) U10.5(D_(SDI))

Not connected (* = marked no-connect by the designer): U5 72(CMPCS_B_2)

### Layout directives
net class JTAG: TCK, TDI, TDO, TMS

### Notes on the sheet
- VCC_AUX
- Decoupling cap configuration recommended by Xilinx UG393 (V1.2) for Spartan 6 power distribution
- Wiring options to test ASYNC Bit Banging with the FTDI from PC
  1) Wire to Serial CFG pins
  2) Wire to FPGA JTAG pins
- M[1:0] pull ups are set to select slave serial config by default.  See UG380 p40 for pin descriptions.
- See Page 52 of UG380 V2.3.   Pads for parallel CCLK Termination
- MUX SELECT
  1 = LPC Config
  0 = PI/Bone conifg = Sys SPI
- Labels drawn without touching a wire or pin: FPGA_SLAVE_CFG_CCLK, FPGA_SLAVE_CFG_DIN, SLAVE_CFG_DONE, SLAVE_CFG_INIT_B, SLAVE_CFG_PROG_B, TCK, TDI, TDO, TMS
- Title
- Revision:
- Sheet
- of
- Date:
- Engineer:

### Library data of the parts
C7 C8 C11 C18-C22 C24 C29 C36 C43 C44 C48 = GRM188R60J475KE19D: as C10 on sheet POWER_SUPPLY; Supplier 1: Digi-Key; Supplier Part Number 1: 490-3297-1-ND; Manufacturer Part Number: GRM188R60J475KE19D; RoHS: RoHS Compliant; Category: Capacitors; Stock 1: 714091; Pricing 1: 10=0.214, 50=0.148, 100=0.1142, 250=0.08204, 500=0.0585, 1000=0.04281 (USD); Voltage - Rated: 6.3V; Temperature Coefficient: X5R; Mounting Type: Surface Mount, MLCC; Operating Temperature: -55°C ~ 85°C; Applications: General Purpose; Ratings: -; Package / Case: 0603 (1608 Metric); Size / Dimension: 0.063" L x 0.031" W (1.60mm x 0.80mm); Height: -; Thickness: 0.035" (0.90mm); Lead Spacing: -; Features: -; Packaging: Cut Tape (CT); Lead Style: -; ComponentLink1URL: http://search.murata.co.jp/Ceramy/image/img/PDF/ENG/GRM188R60J475KE19.pdf; ComponentLink1Description: http://search.murata.co.jp/Ceramy/image/img/PDF/ENG/GRM188R60J475KE19.pdf; Value: 4.7uF
C13 C14 C23 C25 C26 C34 C40-C42 C45-C47 = GCM188R71E474KA64D: CAP CER .47UF 25V X7R 0603; Manufacturer: Murata Electronics North America; Capacitance: 0.47µF; Tolerance: ±10%; Supplier 1: Digi-Key; Supplier Part Number 1: 490-4776-1-ND; Manufacturer Part Number: GCM188R71E474KA64D; RoHS: RoHS Compliant; Category: Capacitors; Stock 1: 120782; Pricing 1: 10=0.248, 50=0.1444, 100=0.1155, 250=0.08252, 500=0.0561, 1000=0.04538 (USD); Voltage - Rated: 25V; Temperature Coefficient: X7R; Mounting Type: Surface Mount, MLCC; Operating Temperature: -55°C ~ 125°C; Applications: Automotive; Ratings: AEC-Q200; Package / Case: 0603 (1608 Metric); Size / Dimension: 0.063" L x 0.031" W (1.60mm x 0.80mm); Height: -; Thickness: 0.035" (0.90mm); Lead Spacing: -; Features: -; Packaging: Cut Tape (CT); Lead Style: -; ComponentLink1URL: http://search.murata.co.jp/Ceramy/image/img/PDF/ENG/GCM188R71E474KA64.pdf; ComponentLink1Description: http://search.murata.co.jp/Ceramy/image/img/PDF/ENG/GCM188R71E474KA64.pdf; Value: 0.47uF
C28 = GRM188R71H104KA93D: as C9 on sheet POWER_SUPPLY; Manufacturer Part Number: GRM188R71H104KA93D; Value: CAP CER .1UF 50V 10% X7R 0603; Supplier 1: Digi-Key; Supplier Part Number 1: 490-1519-1-ND; RoHS: RoHS Compliant; Category: Capacitors; Stock 1: 9370695; Pricing 1: 10=0.037, 100=0.0221, 500=0.01276, 1000=0.00884 (USD); Voltage - Rated: 50V; Tolerance: ±10%; Temperature Coefficient: X7R; Mounting Type: Surface Mount, MLCC; Operating Temperature: -55°C ~ 125°C; Features: -; Applications: General Purpose; Ratings: -; Package / Case: 0603 (1608 Metric); Size / Dimension: 0.063" L x 0.031" W (1.60mm x 0.80mm); Lead Spacing: -; Thickness: 0.80mm; Packaging: Cut Tape (CT); Lead Style: -; ComponentLink1URL: http://search.murata.co.jp/Ceramy/image/img/PDF/ENG/GRM188R71H104KA93.pdf; ComponentLink1Description: http://search.murata.co.jp/Ceramy/image/img/PDF/ENG/GRM188R71H104KA93.pdf
D5 = APT1608CGCK: LED 1.6X0.8MM 570NM GRN CLR SMD; Manufacturer: Kingbright Corp; Color: Green; Current - Test: 20mA; Wavelength - Peak: 574nm; Millicandela Rating: 50mcd; Voltage - Forward (Vf) Typ: 2.1V; Lens Type: Clear; Lens Style/Size: Rectangle with Flat Top, 1.2mm x 0.8mm; Viewing Angle: 120°; Supplier 1: Digi-Key; Manufacturer Part Number: APT1608CGCK; RoHS: RoHS Compliant; Category: Optoelectronics; Stock 1: 98122; Pricing 1: 1=0.2, 10=0.153, 25=0.1224, 100=0.1105, 250=0.102, 500=0.0918 (USD); Luminous Flux @ Current - Test: -; Wavelength - Dominant: 570nm; Size / Dimension: 1.60mm L x 0.80mm W; Height: 0.75mm; Package / Case: 0603 (1608 Metric); Mounting Type: Surface Mount; Packaging: Cut Tape (CT); ComponentLink1URL: http://www.us.kingbright.com/images/catalog/SPEC/APT1608CGCK.pdf; ComponentLink1Description: http://www.us.kingbright.com/images/catalog/SPEC/APT1608CGCK.pdf
J7 = JTAG - Digilent HS1: DIGILENT - 410-205 - PROGRAMMING CABLE, JTAG HS1, USB2; Manufacturer: Samtec; Manufacturer Part Number: TSW-106-08-G-S-RA; Description: Conn Unshrouded Header HDR 6 POS 2.54mm Solder RA Thru-Hole; Lead Time: 0 weeks; Peak Solder Temperature: 260 deg C; MSL Level Min: N/R; Connector Type: Header, Unshrouded; Number of Positions: 6; Number of Positions Loaded: All; Pitch: 0.100" (2.54mm); Supplier 1: Arrow; RoHS: CHINA ROHS: Compliant / EU ROHS: Compliant; Stock 1: 0; Pricing 1: 0=0.2649 (USD); ComponentLink1URL: http://components.arrow.com/partservice/dataview/altium/2677508S3639200N1004?apiKey=aa438727d59eed98c4bed826d8d949c84cb5e685b92bf87346a0226bd2658797; ComponentLink1Description: http://components.arrow.com/partservice/dataview/altium/2677508S3639200N1004?apiKey=aa438727d59eed98c4bed826d8d949c84cb5e685b92bf87346a0226bd2658797; Supplier Part Number 1: 2677508S3639200N1004; Package Quantity: 1; Termination Finish: Au/Ni; MSL Level Max: N/R; MSL (Moisture Sensitivity Level): N/R; China ROHS Lead (X -> above / O -> below threshold): O; China ROHS Mercury (X -> above / O -> below threshold): O; China ROHS Cadmium (X -> above / O -> below threshold): O; China ROHS Hex Chromium (X -> above / O -> below threshold): O; China ROHS PBB (X -> above / O -> below threshold): O; China ROHS PBDE (X -> above / O -> below threshold): O; EU_ROHS_PROD_EXEMPTION_BY_SUPP: N/R; Supplier 2: Digi-Key; Category: Connectors, Interconnects; Stock 2: 0; Pricing 2: 1=0.94, 10=0.841, 100=0.6926, 500=0.5475, 1000=0.46999, 5000=0.42877, 10000=0.41228 (USD); Contact Type: Male Pin; Number of Rows: 1; Row Spacing: -; Contact Mating Length: 0.230" (5.84mm); Mounting Type: Through Hole; Termination: Solder; Fastening Type: -; Features: -; Contact Finish: Gold; Contact Finish Thickness: 10µin (0.25µm); Color: Black; Packaging: Bulk; ComponentLink2URL: http://www.samtec.com/documents/webfiles/cpdf/TSW-XXX-XX-XXX-X-XX-XXX-MKT.pdf; ComponentLink2Description: http://www.samtec.com/documents/webfiles/cpdf/TSW-XXX-XX-XXX-X-XX-XXX-MKT.pdf; Supplier Part Number 2: SAM1038-06-ND
J16 J17 = Solder Jumper: Solder/Configuration Jumper; Manufacturer: n/a; Manufacturer Part Number: n/a; Source: n/a; Source Part Number: n/a; ROHS Certificate: n/a
P9 = Header6: Header 6 pin
R24 R27 R32 R35 R38 R39 R49 R50 = ERJ-3EKF1002V: RES 10.0K OHM 1/10W 1% 0603 SMD; Manufacturer: Panasonic - ECG; Power (Watts): 0.1W, 1/10W; Temperature Coefficient: ±100ppm/°C; Manufacturer Part Number: ERJ-3EKF1002V; Value: 10k; Supplier 1: Digi-Key; RoHS: RoHS Compliant; Category: Resistors; Stock 1: 11168880; Pricing 1: 1=0.04, 50=0.015, 100=0.0114, 250=0.00844, 500=0.00624, 1000=0.00416 (USD); Resistance (Ohms): 10.0K; Composition: Thick Film; Features: -; Tolerance: ±1%; Size / Dimension: 0.063" L x 0.031" W (1.60mm x 0.80mm); Height: 0.018" (0.45mm); Lead Style: Surface Mount (SMD - SMT); Packaging: Cut Tape (CT); Package / Case: 0603 (1608 Metric); ComponentLink1URL: http://industrial.panasonic.com/www-cgi/jvcr13pz.cgi?E+PZ+3+AOA0002+ERJ3EKF1002V+7+WW; ComponentLink1Description: http://industrial.panasonic.com/www-cgi/jvcr13pz.cgi?E+PZ+3+AOA0002+ERJ3EKF1002V+7+WW; Supplier Part Number 1: P10.0KHCT-ND
R31 R34 = R0603 - CRCW0603100RFKEA: 100 ohms 1% Thick Film Resistors - SMD 1/10watt; Manufacturer: Vishay/Dale; Description: Thick Film Resistors - SMD 1/10watt 100ohms 1%; Power Rating: 0.1 Watt (1/10 Watt); Temperature Coefficient: 100 PPM / K; Voltage Rating: 75 Volts; Supplier 1: Mouser; Manufacturer Part Number: CRCW0603100RFKEA; RoHS: RoHS Compliant By Exemption; Category: Thick Film Resistors - SMD; Stock 1: 243353; Pricing 1: 1=0.108, 25=0.054, 100=0.034, 1000=0.020, 2000=0.018, 5000=0.008, 10000=0.007, 50000=0.005 (AUD); Dimensions: 0.85 mm W x 1.55 mm L x 0.45 mm H; Operating Temperature Range: - 55 C to + 155 C; Package / Case: 0603 (1608 metric); Packaging: Reel; Product: Thick Film Resistors SMD; Resistance: 100 Ohms; Series: CRCW; Termination Style: SMD/SMT; Tolerance: 1 %; Product Category: 0603 Thick Film Chip Resistors; Standard Pack Qty: 5000; RoHS - Mouser: E; Minimum Order Quantity: 1; Reeling: True; ComponentLink1URL: http://www.vishay.com/doc?20035; ComponentLink1Description: http://www.vishay.com/doc?20035; Supplier Part Number 1: 71-CRCW0603-100-E3; Value: 100
R37 = ERJ-3EKF2000V: RES 200 OHM 1/10W 1% 0603 SMD; Manufacturer: Panasonic - ECG; Power (Watts): 0.1W, 1/10W; Temperature Coefficient: ±100ppm/°C; Manufacturer Part Number: ERJ-3EKF2000V; Value: RES 200 OHM 1/10W 1% 0603 SMD; Supplier 1: Digi-Key; Supplier Part Number 1: P200HCT-ND; RoHS: RoHS Compliant; Category: Resistors; Stock 1: 1279595; Pricing 1: 1=0.04, 50=0.015, 100=0.0114, 250=0.00844, 500=0.00624, 1000=0.00416 (USD); Resistance (Ohms): 200; Composition: Thick Film; Features: -; Tolerance: ±1%; Size / Dimension: 0.063" L x 0.031" W (1.60mm x 0.80mm); Height: 0.018" (0.45mm); Lead Style: Surface Mount (SMD - SMT); Packaging: Cut Tape (CT); Package / Case: 0603 (1608 Metric); ComponentLink1URL: http://industrial.panasonic.com/www-cgi/jvcr13pz.cgi?E+PZ+3+AOA0002+ERJ3EKF2000V+7+WW; ComponentLink1Description: http://industrial.panasonic.com/www-cgi/jvcr13pz.cgi?E+PZ+3+AOA0002+ERJ3EKF2000V+7+WW
U5 = XC6SLX9-3TQG144C: as U5 on sheet LOGIC_FPGA; Supplier 1: Digi-Key; Supplier Part Number 1: 122-1747-ND; Manufacturer Part Number: XC6SLX9-3TQG144C; RoHS: RoHS Compliant; Category: Integrated Circuits (ICs); Stock 1: 77; Pricing 1: 1=17.22 (USD); Number of Gates: -; Mounting Type: Surface Mount; Operating Temperature: 0°C ~ 85°C; Package / Case: 144-LQFP; Supplier Device Package: 144-TQFP (20x20); ComponentLink1URL: http://www.xilinx.com/support/documentation/data_sheets/ds160.pdf; ComponentLink1Description: http://www.xilinx.com/support/documentation/data_sheets/ds160.pdf; Value: XC6SLX9-3TQG144C
U7 U8 = MUX - SN74AUP1T157DCKR: IC BUFF/MUX SCHMITT-TRIG SC70-6; Manufacturer: Texas Instruments; Circuit: 1 x 3:1; Independent Circuits: 1; Current - Output High, Low: 4mA, 4mA; Voltage Supply Source: Single Supply; Voltage - Supply: 2.3 V ~ 3.6 V; Supplier 1: Digi-Key; Manufacturer Part Number: SN74AUP1T157DCKR; RoHS: RoHS Compliant; Category: Integrated Circuits (ICs); Stock 1: 1261; Pricing 1: 1=0.4, 10=0.315, 25=0.266, 100=0.2166, 250=0.1794, 500=0.1482, 1000=0.111 (USD); Type: Multiplexer; Operating Temperature: -40°C ~ 85°C; Mounting Type: Surface Mount; Package / Case: 6-TSSOP, SC-88, SOT-363; Supplier Device Package: SC-70-6; Packaging: Cut Tape (CT); ComponentLink1URL: http://www.ti.com/lit/ds/symlink/sn74aup1t157.pdf; ComponentLink1Description: http://www.ti.com/lit/ds/symlink/sn74aup1t157.pdf; Supplier Part Number 1: 296-27393-1-ND; Value: MUX2
U10 = M25PE16-VMW6TG: IC FLASH 16MBIT 75MHZ 8SOIC; Manufacturer: Numonyx/ST Micro; Memory Size: 16M (2M x 8); Interface: SPI, 3-Wire Serial; Voltage - Supply: 2.7 V ~ 3.6 V; Supplier 1: Digi-Key; Manufacturer Part Number: M25PE16-VMW6TG; RoHS: RoHS Compliant; Category: Integrated Circuits (ICs); Stock 1: 866; Pricing 1: 1=2.31, 10=1.98, 25=1.782, 100=1.617, 250=1.452, 500=1.254 (USD); Format - Memory: FLASH; Memory Type: FLASH; Speed: 75MHz; Operating Temperature: -40°C ~ 85°C; Package / Case: 8-SOIC (0.200", 5.30mm Width); Packaging: Cut Tape (CT); Supplier Device Package: *; ComponentLink1URL: http://www.numonyx.com/Documents/Datasheets/M25PE16.pdf; ComponentLink1Description: http://www.numonyx.com/Documents/Datasheets/M25PE16.pdf; Supplier Part Number 1: M25PE16-VMW6TGCT-ND; Value: M25PE16

## Sheet DIGITAL_IO.SchDoc: Digital IO
size B; Engineer: M. Jones; Organization: Michael Jones; DocumentNumber: 4; Revision: RA.1; SheetNumber: 4; SheetTotal: 7
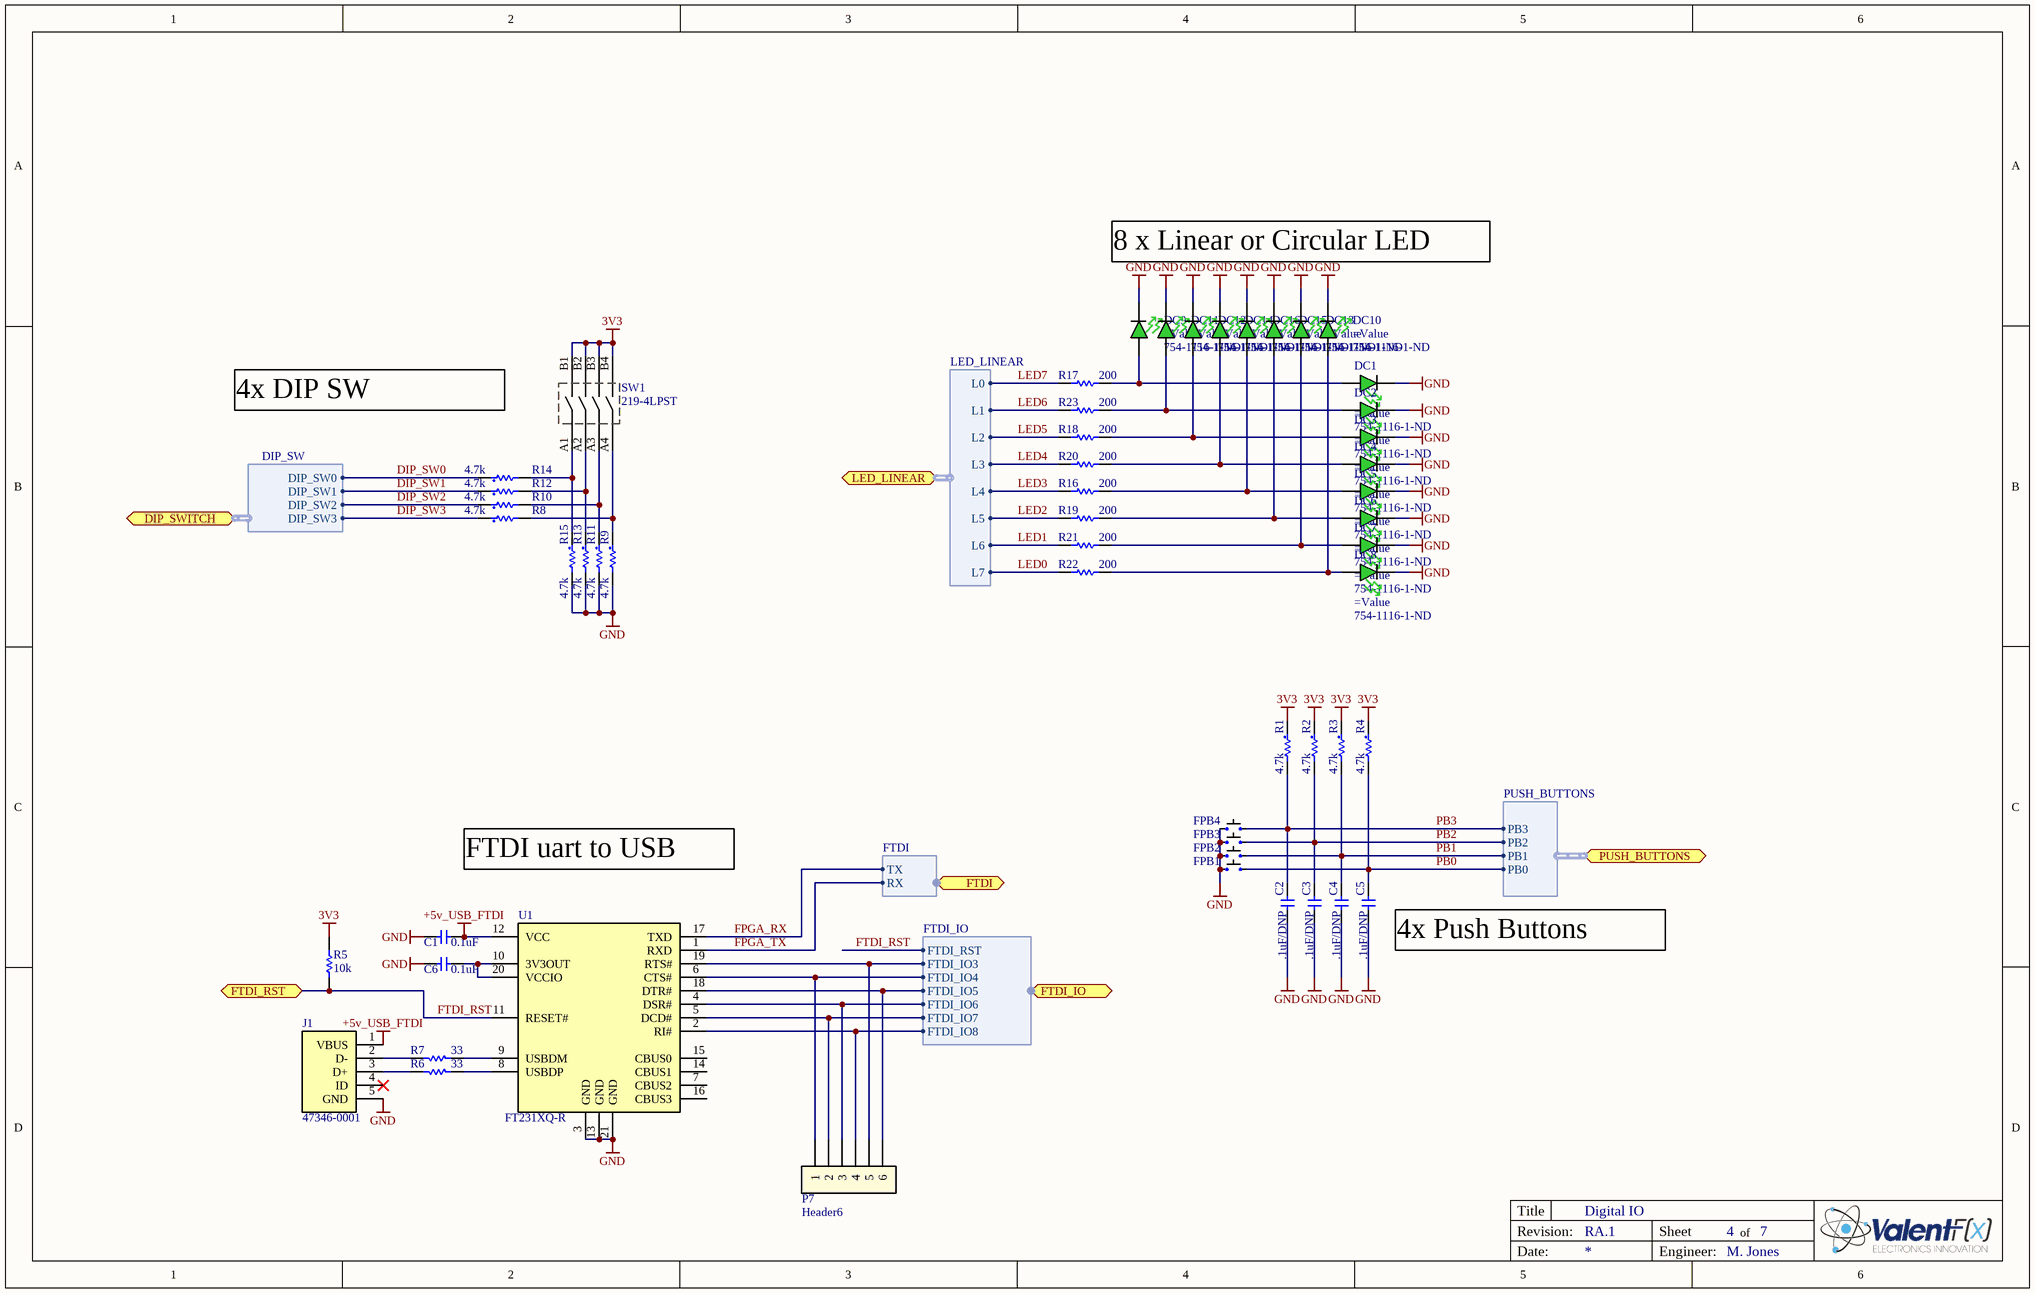
[diagram p3: DIGITAL_IO.SchDoc]

### Parts
C1  0.1uF  [C0603]
C2  .1uF/DNP  [C0603]
C3  .1uF/DNP  [C0603]
C4  .1uF/DNP  [C0603]
C5  .1uF/DNP  [C0603]
C6  0.1uF  [C0603]
DC1  Supplier Part Number 1: 754-1116-1-ND  [LED_0603 - GREEN]
DC2  Supplier Part Number 1: 754-1116-1-ND  [LED_0603 - GREEN]
DC3  Supplier Part Number 1: 754-1116-1-ND  [LED_0603 - GREEN]
DC4  Supplier Part Number 1: 754-1116-1-ND  [LED_0603 - GREEN]
DC5  Supplier Part Number 1: 754-1116-1-ND  [LED_0603 - GREEN]
DC6  Supplier Part Number 1: 754-1116-1-ND  [LED_0603 - GREEN]
DC7  Supplier Part Number 1: 754-1116-1-ND  [LED_0603 - GREEN]
DC8  Supplier Part Number 1: 754-1116-1-ND  [LED_0603 - GREEN]
DC9  Supplier Part Number 1: 754-1116-1-ND  [LED_0603 - GREEN]
DC10  Supplier Part Number 1: 754-1116-1-ND  [LED_0603 - GREEN]
DC11  Supplier Part Number 1: 754-1116-1-ND  [LED_0603 - GREEN]
DC12  Supplier Part Number 1: 754-1116-1-ND  [LED_0603 - GREEN]
DC13  Supplier Part Number 1: 754-1116-1-ND  [LED_0603 - GREEN]
DC14  Supplier Part Number 1: 754-1116-1-ND  [LED_0603 - GREEN]
DC15  Supplier Part Number 1: 754-1116-1-ND  [LED_0603 - GREEN]
DC16  Supplier Part Number 1: 754-1116-1-ND  [LED_0603 - GREEN]
FPB1  (no value)  [FSM4JSMA]
FPB2  (no value)  [FSM4JSMA]
FPB3  (no value)  [FSM4JSMA]
FPB4  (no value)  [FSM4JSMA]
J1  47346-0001  [USB - 47346-0001]
P7  Header6  [HEADER_6_30_100 SMT SIP]
R1  4.7k  [R0603]
R2  4.7k  [R0603]
R3  4.7k  [R0603]
R4  4.7k  [R0603]
R5  10k  [R0603]
R6  33  [R0603]
R7  33  [R0603]
R8  4.7k  [R0603]
R9  4.7k  [R0603]
R10  4.7k  [R0603]
R11  4.7k  [R0603]
R12  4.7k  [R0603]
R13  4.7k  [R0603]
R14  4.7k  [R0603]
R15  4.7k  [R0603]
R16  200  [R0603]
R17  200  [R0603]
R18  200  [R0603]
R19  200  [R0603]
R20  200  [R0603]
R21  200  [R0603]
R22  200  [R0603]
R23  200  [R0603]
SW1  219-4LPST  [ADE04S04]
U1  FT231XQ-R  [QFN-20_L]

### Ports
DIP_SWITCH (harness DIP_SW), FTDI (harness FTDI), FTDI_IO (harness FTDI_IO), FTDI_RST, LED_LINEAR (harness LED_LINEAR), PUSH_BUTTONS (harness PUSH_BUTTONS)

### Harnesses
PUSH_BUTTONS: PB0, PB1, PB2, PB3
LED_LINEAR: L0, L1, L2, L3, L4, L5, L6, L7
FTDI: TX, RX
FTDI_IO: FTDI_IO3, FTDI_IO4, FTDI_IO5, FTDI_IO6, FTDI_IO7, FTDI_IO8, FTDI_RST
DIP_SW: DIP_SW0, DIP_SW1, DIP_SW2, DIP_SW3

### Nets
3V3: R1.1 R2.1 R3.1 R4.1 R5.1 SW1.B1 SW1.B2 SW1.B3 SW1.B4
+5v_USB_FTDI: C1.2 J1.1(VBUS) U1.12(VCC)
GND: C1.1 C2.2 C3.2 C4.2 C5.2 C6.1 DC1.C DC2.C DC3.C DC4.C DC5.C DC6.C DC7.C DC8.C DC9.C DC10.C DC11.C DC12.C DC13.C DC14.C DC15.C DC16.C FPB1.A FPB2.A FPB3.A FPB4.A J1.5(GND) R9.2 R11.2 R13.2 R15.2 U1.3(GND) U1.13(GND) U1.21(GND)
DIP_SW0: R14.1 ; port DIP_SWITCH.DIP_SW0
DIP_SW1: R12.1 ; port DIP_SWITCH.DIP_SW1
DIP_SW2: R10.1 ; port DIP_SWITCH.DIP_SW2
DIP_SW3: R8.1 ; port DIP_SWITCH.DIP_SW3
FPGA_RX: U1.17(TXD) ; port FTDI.TX
FPGA_TX: U1.1(RXD) ; port FTDI.RX
FTDI_RST: R5.2 U1.11(RESET#) ; port FTDI_RST, port FTDI_IO.FTDI_RST
LED0: R22.2 ; port LED_LINEAR.L7
LED1: R21.2 ; port LED_LINEAR.L6
LED2: R19.2 ; port LED_LINEAR.L5
LED3: R16.2 ; port LED_LINEAR.L4
LED4: R20.2 ; port LED_LINEAR.L3
LED5: R18.2 ; port LED_LINEAR.L2
LED6: R23.2 ; port LED_LINEAR.L1
LED7: R17.2 ; port LED_LINEAR.L0
PB0: C5.1 FPB1.B R4.2 ; port PUSH_BUTTONS.PB0
PB1: C4.1 FPB2.B R3.2 ; port PUSH_BUTTONS.PB1
PB2: C3.1 FPB3.B R2.2 ; port PUSH_BUTTONS.PB2
PB3: C2.1 FPB4.B R1.2 ; port PUSH_BUTTONS.PB3
NetC6_2: C6.2 U1.10(3V3OUT) U1.20(VCCIO)
NetDC1_A: DC1.A DC9.A R17.1
NetDC2_A: DC2.A DC11.A R23.1
NetDC3_A: DC3.A DC12.A R18.1
NetDC4_A: DC4.A DC14.A R20.1
NetDC5_A: DC5.A DC16.A R16.1
NetDC6_A: DC6.A DC15.A R19.1
NetDC7_A: DC7.A DC13.A R21.1
NetDC8_A: DC8.A DC10.A R22.1
NetJ1_2: J1.2(D-) R7.2
NetJ1_3: J1.3(D+) R6.2
NetP7_1: P7.1 U1.6(CTS#) ; port FTDI_IO.FTDI_IO4
NetP7_2: P7.2 U1.5(DCD#) ; port FTDI_IO.FTDI_IO7
NetP7_3: P7.3 U1.4(DSR#) ; port FTDI_IO.FTDI_IO6
NetP7_4: P7.4 U1.2(RI#) ; port FTDI_IO.FTDI_IO8
NetP7_5: P7.5 U1.19(RTS#) ; port FTDI_IO.FTDI_IO3
NetP7_6: P7.6 U1.18(DTR#) ; port FTDI_IO.FTDI_IO5
NetR6_1: R6.1 U1.8(USBDP)
NetR7_1: R7.1 U1.9(USBDM)
NetR8_2: R8.2 R9.1 SW1.A4
NetR10_2: R10.2 R11.1 SW1.A3
NetR12_2: R12.2 R13.1 SW1.A2
NetR14_2: R14.2 R15.1 SW1.A1

Not connected (* = marked no-connect by the designer): J1 4(ID)*; U1 7(CBUS2) 14(CBUS1) 15(CBUS0) 16(CBUS3)

### Notes on the sheet
- 8 x Linear or Circular LED
- 4x DIP SW
- FTDI uart to USB
- (near C5) 4x Push Buttons
- Title
- Revision:
- Sheet
- of
- Date:
- Engineer:

### Library data of the parts
C1 C6 = GRM188R71H104KA93D: as C9 on sheet POWER_SUPPLY; Value: 0.1uF; Supplier 1: Digi-Key; Supplier Part Number 1: 490-1519-1-ND; Manufacturer Part Number: GRM188R71H104KA93D; RoHS: RoHS Compliant; Category: Capacitors; Stock 1: 6315460; Pricing 1: 10=0.037, 100=0.0221, 500=0.01276, 1000=0.00884 (USD); Voltage - Rated: 50V; Tolerance: ±10%; Temperature Coefficient: X7R; Mounting Type: Surface Mount, MLCC; Operating Temperature: -55°C ~ 125°C; Features: -; Applications: General Purpose; Ratings: -; Package / Case: 0603 (1608 Metric); Size / Dimension: 0.063" L x 0.031" W (1.60mm x 0.80mm); Lead Spacing: -; Thickness: 0.80mm; Packaging: Cut Tape (CT); Lead Style: -; ComponentLink1URL: http://search.murata.co.jp/Ceramy/image/img/PDF/ENG/GRM188R71H104KA93.pdf; ComponentLink1Description: http://search.murata.co.jp/Ceramy/image/img/PDF/ENG/GRM188R71H104KA93.pdf
C2-C5 = GRM188R71H104KA93D: CAP CER .1UF 50V 10% X7R 0603; Manufacturer: Murata Electronics North America; Value: 0.1uF; Capacitance: 0.1µF; Supplier 1: Digi-Key; Supplier Part Number 1: 490-1519-1-ND; Manufacturer Part Number: GRM188R71H104KA93D; RoHS: RoHS Compliant; Category: Capacitors; Stock 1: 6315460; Pricing 1: 10=0.037, 100=0.0221, 500=0.01276, 1000=0.00884 (USD); Voltage - Rated: 50V; Tolerance: ±10%; Temperature Coefficient: X7R; Mounting Type: Surface Mount, MLCC; Operating Temperature: -55°C ~ 125°C; Features: -; Applications: General Purpose; Ratings: -; Package / Case: 0603 (1608 Metric); Size / Dimension: 0.063" L x 0.031" W (1.60mm x 0.80mm); Lead Spacing: -; Thickness: 0.80mm; Packaging: Cut Tape (CT); Lead Style: -; ComponentLink1URL: http://search.murata.co.jp/Ceramy/image/img/PDF/ENG/GRM188R71H104KA93.pdf; ComponentLink1Description: http://search.murata.co.jp/Ceramy/image/img/PDF/ENG/GRM188R71H104KA93.pdf
DC1-DC16 = APT1608CGCK: LED 1.6X0.8MM 570NM GRN CLR SMD; Manufacturer: Kingbright Corp; Current - Test: 20mA; Wavelength - Peak: 574nm; Millicandela Rating: 50mcd; Voltage - Forward (Vf) Typ: 2.1V; Lens Type: Clear; Lens Style/Size: Rectangle with Flat Top, 1.2mm x 0.8mm; Viewing Angle: 120°; Supplier 1: Digi-Key; Manufacturer Part Number: APT1608CGCK; RoHS: RoHS Compliant; Category: Optoelectronics; Stock 1: 98122; Pricing 1: 1=0.2, 10=0.153, 25=0.1224, 100=0.1105, 250=0.102, 500=0.0918 (USD); Color: Green; Luminous Flux @ Current - Test: -; Wavelength - Dominant: 570nm; Size / Dimension: 1.60mm L x 0.80mm W; Height: 0.75mm; Package / Case: 0603 (1608 Metric); Mounting Type: Surface Mount; Packaging: Cut Tape (CT); ComponentLink1URL: http://www.us.kingbright.com/images/catalog/SPEC/APT1608CGCK.pdf; ComponentLink1Description: http://www.us.kingbright.com/images/catalog/SPEC/APT1608CGCK.pdf
FPB1-FPB4 = FSM4JSMATR: SWITCH TACTILE SPST-NO 0.05A 12V; Manufacturer: TE Connectivity; Switch Function: Off-Mom; Contact Rating @ Voltage: 0.05A @ 12VDC; Actuator Type: Standard; Outline: 6.00mm x 6.00mm; Illumination: Non-Illuminated; Operating Force: 160gf; Actuator Height off PCB, from Pins: 5.00mm; Actuator Orientation: Top Actuated; Actuator Material: Polyphenylene Sulfide (PPS); Switch Travel: 0.25mm; Mechanical Life: 100,000 Cycles; Supplier 1: Digi-Key; Supplier Part Number 1: 450-1129-ND; Manufacturer Part Number: FSM4JSMA; RoHS: RoHS Compliant; Category: Switches; Stock 1: 13038; Pricing 1: 1=0.26, 10=0.246, 25=0.2096, 50=0.1834, 100=0.1703, 250=0.15064, 500=0.1441, 1000=0.1179, 5000=0.09825 (USD); Circuit: SPST-NO; Mounting Type: Surface Mount; Termination Style: Gull Wing; Packaging: Bulk; ComponentLink1URL: http://www.te.com/commerce/DocumentDelivery/DDEController?Action=srchrtrv&DocNm=2-1437565-7&DocType=Customer+Drawing&DocLang=English; ComponentLink1Description: http://www.te.com/commerce/DocumentDelivery/DDEController?Action=srchrtrv&DocNm=2-1437565-7&DocType=Customer+Drawing&DocLang=English; Illumination Voltage (Nominal): -; Illumination Type, Color: -; Ingress Protection: -; Features: -; Operating Temperature: -35°C ~ 85°C
J1 = USB - 0473460001: Micro B CONN RCPT 5POS MICRO B USB R/A; Manufacturer: Molex Inc; Description: CONN RCPT 5POS MICRO USB R/A; Connector Type: USB - micro B; Number of Contacts: 5; Gender: Receptacle; Supplier 1: Digi-Key; Manufacturer Part Number: 0473460001; RoHS: RoHS Compliant; Category: Connectors, Interconnects; Stock 1: 2501; Pricing 1: 1=1, 10=0.877, 25=0.8252, 50=0.7906, 100=0.7563, 250=0.68752, 500=0.61876, 1000=0.55 (USD); Specifications: -; Mounting Type: Surface Mount, Right Angle, Horizontal; Features: Shielded; Packaging: Cut Tape (CT); Ingress Protection: -; ComponentLink1URL: http://www.molex.com/pdm_docs/sd/473460001_sd.pdf; ComponentLink1Description: http://www.molex.com/pdm_docs/sd/473460001_sd.pdf; Supplier Part Number 1: WM17141CT-ND; Value: 47346-0001
P7 = Header6: Header 6 pin
R1-R4 R8-R15 = R0603 - CRCW06034K70FKEA: 4.7k Thick Film Resistors - SMD 1/10watt 4.7Kohms 1%; Manufacturer: Vishay Dale; Description: RES 4.70K OHM 1/10W 1% 0603 SMD; Power (Watts): 0.1W, 1/10W; Temperature Coefficient: ±100ppm/°C; Supplier 1: Digi-Key; Manufacturer Part Number: CRCW06034K70FKEA; RoHS: RoHS Compliant; Category: Resistors; Stock 1: 51919; Pricing 1: 10=0.081, 50=0.0436, 200=0.0251, 1000=0.01711 (USD); Resistance (Ohms): 4.7K; Composition: Thick Film; Features: -; Tolerance: ±1%; Package / Case: 0603 (1608 Metric); Size / Dimension: 0.061" L x 0.033" W (1.55mm x 0.85mm); Height: 0.020" (0.50mm); Number of Terminations: 2; Packaging: Cut Tape (CT); ComponentLink1URL: http://www.vishay.com/doc?20035; ComponentLink1Description: http://www.vishay.com/doc?20035; Supplier Part Number 1: 541-4.70KHCT-ND; Value: 4.7k
R5 = ERJ-3EKF1002V: RES 10.0K OHM 1/10W 1% 0603 SMD; Source Part Number: P10.0KHCT-ND; Manufacturer: Panasonic - ECG; Power (Watts): 0.1W, 1/10W; Temperature Coefficient: ±100ppm/°C; Source: Digikey; ROHS Certificate: *; RoHS: RoHS Compliant; Category: Resistors; Resistance In Ohms: 10.0K; Composition: Thick Film; Features: -; Tolerance: ±1%; Case: 0603 (1608 metric); Size / Dimension: 0.063" L x 0.031" W (1.60mm x 0.80mm); Height: 0.018" (0.45mm); Lead Style: Surface Mount (SMD - SMT); Packaging: Cut Tape (CT); ComponentLink1URL: http://industrial.panasonic.com/www-cgi/jvcr13pz.cgi?E+PZ+3+AOA0002+ERJ3EKF1002V+7+WW; ComponentLink1Description: http://industrial.panasonic.com/www-cgi/jvcr13pz.cgi?E+PZ+3+AOA0002+ERJ3EKF1002V+7+WW; Manufacturer Part Number: ERJ-3EKF1002V; Supplier 1: Digi-Key; Stock 1: 10570746; Pricing 1: 1=0.04, 50=0.015, 100=0.0114, 250=0.00844, 500=0.00624, 1000=0.00416 (USD); Supplier Part Number 1: P10.0KHCT-ND; Value: 10k
R6 R7 = ERJ-3EKF33R0V: RES 33.0 OHM 1/10W 1% 0603 SMD; Manufacturer: Panasonic - ECG; Power (Watts): 0.1W, 1/10W; Temperature Coefficient: ±100ppm/°C; Value: 33; Supplier 1: Digi-Key; Manufacturer Part Number: ERJ-3EKF33R0V; RoHS: RoHS Compliant; Category: Resistors; Stock 1: 1263163; Pricing 1: 1=0.04, 50=0.0138, 100=0.0105, 250=0.0078, 500=0.00576, 1000=0.00384 (USD); Resistance (Ohms): 33; Composition: Thick Film; Features: -; Tolerance: ±1%; Size / Dimension: 0.063" L x 0.031" W (1.60mm x 0.80mm); Height: 0.018" (0.45mm); Number of Terminations: 2; Packaging: Cut Tape (CT); Package / Case: 0603 (1608 Metric); ComponentLink1URL: http://industrial.panasonic.com/www-cgi/jvcr13pz.cgi?E+PZ+3+AOA0002+ERJ3EKF33R0V+7+WW; ComponentLink1Description: http://industrial.panasonic.com/www-cgi/jvcr13pz.cgi?E+PZ+3+AOA0002+ERJ3EKF33R0V+7+WW; Supplier Part Number 1: P33.0HCT-ND
R16-R23 = ERJ-3EKF2000V: as R37 on sheet FPGA_POWER_AND_CONFIGURATION; Manufacturer Part Number: ERJ-3EKF2000V; Value: RES 200 OHM 1/10W 1% 0603 SMD; Supplier 1: Digi-Key; Supplier Part Number 1: P200HCT-ND; RoHS: RoHS Compliant; Category: Resistors; Stock 1: 1279595; Pricing 1: 1=0.04, 50=0.015, 100=0.0114, 250=0.00844, 500=0.00624, 1000=0.00416 (USD); Resistance (Ohms): 200; Composition: Thick Film; Features: -; Tolerance: ±1%; Size / Dimension: 0.063" L x 0.031" W (1.60mm x 0.80mm); Height: 0.018" (0.45mm); Lead Style: Surface Mount (SMD - SMT); Packaging: Cut Tape (CT); Package / Case: 0603 (1608 Metric); ComponentLink1URL: http://industrial.panasonic.com/www-cgi/jvcr13pz.cgi?E+PZ+3+AOA0002+ERJ3EKF2000V+7+WW; ComponentLink1Description: http://industrial.panasonic.com/www-cgi/jvcr13pz.cgi?E+PZ+3+AOA0002+ERJ3EKF2000V+7+WW
SW1 = DIP SW - 219-4LPST: SWITCH TAPE SEAL 4 POS SMD; Manufacturer: CTS Electrocomponents; Circuit: SPST; Number of Positions: 4; Contact Rating @ Voltage: 0.1A @ 50VDC; Actuator Type: Standard; Actuator Level: Flush; Washable: Yes; Supplier 1: Digi-Key; Manufacturer Part Number: 219-4LPST; RoHS: RoHS Compliant; Category: Switches; Stock 1: 0; Pricing 1: 1=0.76, 10=0.744, 100=0.6296, 500=0.54378, 1000=0.50085, 5000=0.40784 (USD); Mounting Type: Surface Mount; Orientation: Top Actuated; ComponentLink1URL: http://www.ctscorp.com/components/Datasheets/219.pdf; ComponentLink1Description: http://www.ctscorp.com/components/Datasheets/219.pdf; Supplier Part Number 1: CT2194LPST-ND; Value: 219-4LPST
U1 = USB - FT231XQ-R: IC USB SERIAL FULL UART QFN-20 ftdi; Manufacturer: FTDI, Future Technology Devices International Ltd; FIFO's: 512 Byte; Number of Channels: 1, UART; Protocol: RS232, RS422, RS485; Voltage - Supply: 3.3 V ~ 5 V; With Auto Flow Control: Yes; Description: IC USB SERIAL FULL UART QFN-20; Category: Integrated Circuits (ICs); Features: USB to UART with Battery Detection; ComponentLink1URL: http://www.ftdichip.com/Support/Documents/DataSheets/ICs/DS_FT231X.pdf; ComponentLink1Description: http://www.ftdichip.com/Support/Documents/DataSheets/ICs/DS_FT231X.pdf; Supplier 1: Digi-Key; Manufacturer Part Number: FT231XQ-R; RoHS: RoHS Compliant; Stock 1: 0; Pricing 1: 1=2.38, 10=2.142, 25=2.0232, 50=1.904, 100=1.785, 250=1.666, 500=1.6065, 1000=1.5827 (USD); With Parallel Port: -; With IrDA Encoder/Decoder: -; With False Start Bit Detection: -; With Modem Control: Yes; With CMOS: Yes; Mounting Type: Surface Mount; Package / Case: 20-WFQFN Exposed Pad; Supplier Device Package: 20-QFN Exposed Pad (4x4); Packaging: Cut Tape (CT); Supplier Part Number 1: 768-1128-1-ND; Value: FT231XQ-R